# Altium schematic sheet Block_Diagram.SchDoc: B152AA Block Diagram
size 292 x 193 mm; SheetNumber: 1; SheetTotal: 5
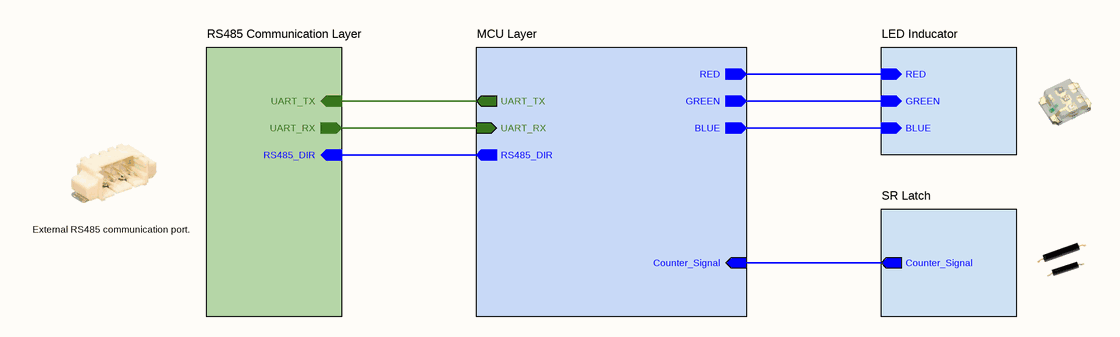
[diagram p0: Block_Diagram.SchDoc]

## Sub-sheets
LED Inducator = LED Inducator.SchDoc: RED (in), BLUE (in), GREEN (in)
MCU Layer = MicroController.SchDoc: UART_TX (out), UART_RX (in), Counter_Signal (in), RS485_DIR (out), GREEN (out), RED (out), BLUE (out)
RS485 Communication Layer = RS485 Communication Layer.SchDoc: RS485_DIR (in), UART_RX (out), UART_TX (in)
SR Latch = SR Latch.SchDoc: Counter_Signal (out)

## Nets
(unnamed): sheet RS485 Communication Layer/RS485_DIR, sheet MCU Layer/RS485_DIR
(unnamed): sheet RS485 Communication Layer/UART_RX, sheet MCU Layer/UART_RX
(unnamed): sheet RS485 Communication Layer/UART_TX, sheet MCU Layer/UART_TX
(unnamed): sheet MCU Layer/Counter_Signal, sheet SR Latch/Counter_Signal
(unnamed): sheet MCU Layer/GREEN, sheet LED Inducator/GREEN
(unnamed): sheet MCU Layer/RED, sheet LED Inducator/RED
(unnamed): sheet MCU Layer/BLUE, sheet LED Inducator/BLUE

## Notes on the sheet
- External RS485 communication port.
- © 2021 All rights reserved.
  This document may not, in whole or in part, be copied, photocopied, reproduced, translated or converted to any electronic or machine readable from without prior written permission of Mehmet Günce Akkoyun.
  Engineer contact : akkoyun@me.com
- Property of
- Engineer :
- Date :
- Size :
- A4
- Time :
- Project :
- Page :
- /
- Customer :
- Product ID :
- Module ID :
- Version :
- File :
- Revision :